# Altium schematic sheet FPGA_IO.SchDoc
size A3
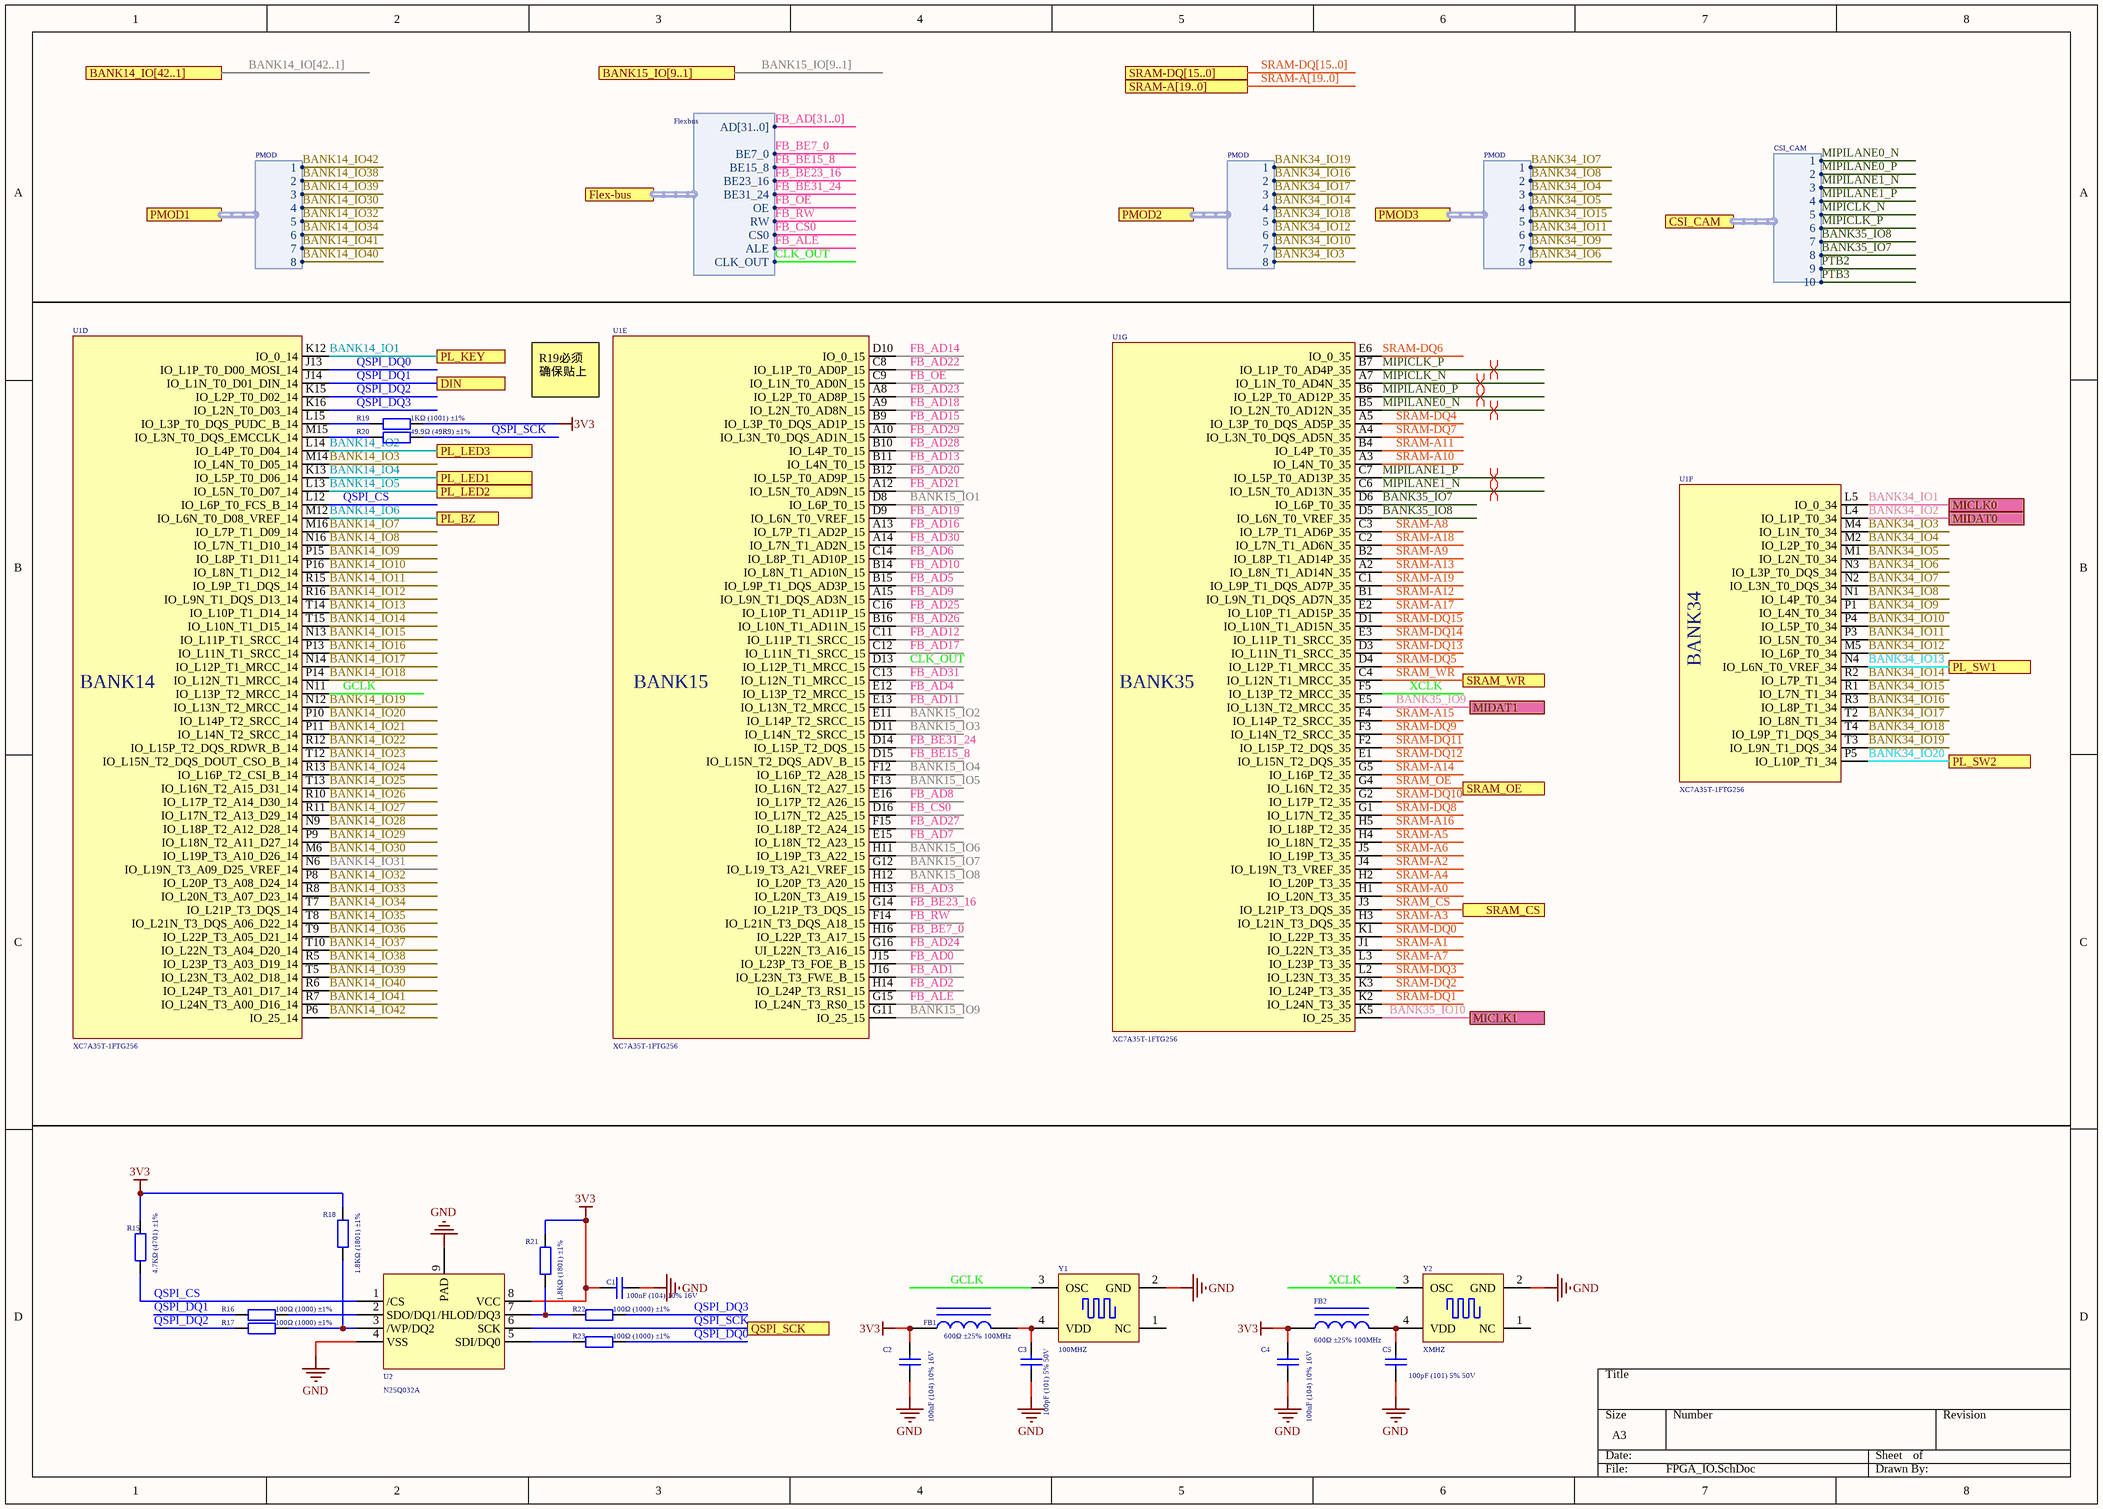
[diagram p0: FPGA_IO.SchDoc]

## Parts
C1  100nF (104) 10% 16V  [0402_C]
C2  100nF (104) 10% 16V  [0402_C]
C3  100pF (101) 5% 50V  [0402_C]
C4  100nF (104) 10% 16V  [0402_C]
C5  100pF (101) 5% 50V  [0402_C]
FB1  600Ω ±25% 100MHz  [0805_L]
FB2  600Ω ±25% 100MHz  [0805_L]
R15  4.7KΩ (4701) ±1%  [0402_R]
R16  100Ω (1000) ±1%  [0402_R]
R17  100Ω (1000) ±1%  [0402_R]
R18  1.8KΩ (1801) ±1%  [0603_R]
R19  1KΩ (1001) ±1%  [0402_R]
R20  49.9Ω (49R9) ±1%  [0402_R]
R21  1.8KΩ (1801) ±1%  [0603_R]
R22  100Ω (1000) ±1%  [0402_R]
R23  100Ω (1000) ±1%  [0402_R]
U1  XC7A35T-1FTG256  [BGA100P9X9-81A]  (parts D,E,F,G of 7)
U2  N25Q032A  [QFN127P500X600X100_HS-9N]
Y1  100MHZ  [XTAL7_3225]
Y2  XMHZ  [XTAL7_3225]

## Ports
BANK14_IO[42..1], BANK15_IO[9..1], CSI_CAM (harness CSI_CAM), DIN, Flex-bus (harness Flexbus), MICLK0, MICLK1, MIDAT0, MIDAT1, PL_BZ, PL_KEY, PL_LED1, PL_LED2, PL_LED3, PL_SW1, PL_SW2, PMOD1 (harness PMOD), PMOD2 (harness PMOD), PMOD3 (harness PMOD), QSPI_SCK, SRAM-A[19..0], SRAM-DQ[15..0], SRAM_CS, SRAM_OE, SRAM_WR

## Harnesses
Flexbus: BE7_0, CS0, BE31_24, CLK_OUT, ALE, BE23_16, RW, BE15_8, OE, AD[31..0]
PMOD: 1, 2, 3, 4, 5, 6, 7, 8
CSI_CAM: 1, 2, 3, 4, 5, 6, 7, 8, 9, 10

## Nets
3V3: C1.1 C2.2 C4.2 FB1.1 FB2.1 R15.2 R18.2 R19.2 R21.2 U2.8(VCC)
GND: C1.2 C2.1 C3.1 C4.1 C5.1 U2.4(VSS) U2.9(PAD) Y1.2(GND) Y2.2(GND)
BANK14_IO1: U1.K12(IO_0_14) ; port PL_KEY
BANK14_IO2: U1.L14(IO_L4P_T0_D04_14) ; port PL_LED3
BANK14_IO3: U1.M14(IO_L4N_T0_D05_14)
BANK14_IO4: U1.K13(IO_L5P_T0_D06_14) ; port PL_LED1
BANK14_IO5: U1.L13(IO_L5N_T0_D07_14) ; port PL_LED2
BANK14_IO6: U1.M12(IO_L6N_T0_D08_VREF_14) ; port PL_BZ
BANK14_IO7: U1.M16(IO_L7P_T1_D09_14)
BANK14_IO8: U1.N16(IO_L7N_T1_D10_14)
BANK14_IO9: U1.P15(IO_L8P_T1_D11_14)
BANK14_IO10: U1.P16(IO_L8N_T1_D12_14)
BANK14_IO11: U1.R15(IO_L9P_T1_DQS_14)
BANK14_IO12: U1.R16(IO_L9N_T1_DQS_D13_14)
BANK14_IO13: U1.T14(IO_L10P_T1_D14_14)
BANK14_IO14: U1.T15(IO_L10N_T1_D15_14)
BANK14_IO15: U1.N13(IO_L11P_T1_SRCC_14)
BANK14_IO16: U1.P13(IO_L11N_T1_SRCC_14)
BANK14_IO17: U1.N14(IO_L12P_T1_MRCC_14)
BANK14_IO18: U1.P14(IO_L12N_T1_MRCC_14)
BANK14_IO19: U1.N12(IO_L13N_T2_MRCC_14)
BANK14_IO20: U1.P10(IO_L14P_T2_SRCC_14)
BANK14_IO21: U1.P11(IO_L14N_T2_SRCC_14)
BANK14_IO22: U1.R12(IO_L15P_T2_DQS_RDWR_B_14)
BANK14_IO23: U1.T12(IO_L15N_T2_DQS_DOUT_CSO_B_14)
BANK14_IO24: U1.R13(IO_L16P_T2_CSI_B_14)
BANK14_IO25: U1.T13(IO_L16N_T2_A15_D31_14)
BANK14_IO26: U1.R10(IO_L17P_T2_A14_D30_14)
BANK14_IO27: U1.R11(IO_L17N_T2_A13_D29_14)
BANK14_IO28: U1.N9(IO_L18P_T2_A12_D28_14)
BANK14_IO29: U1.P9(IO_L18N_T2_A11_D27_14)
BANK14_IO30: U1.M6(IO_L19P_T3_A10_D26_14) ; port PMOD1.4
BANK14_IO31: U1.N6(IO_L19N_T3_A09_D25_VREF_14)
BANK14_IO32: U1.P8(IO_L20P_T3_A08_D24_14) ; port PMOD1.5
BANK14_IO33: U1.R8(IO_L20N_T3_A07_D23_14)
BANK14_IO34: U1.T7(IO_L21P_T3_DQS_14) ; port PMOD1.6
BANK14_IO35: U1.T8(IO_L21N_T3_DQS_A06_D22_14)
BANK14_IO36: U1.T9(IO_L22P_T3_A05_D21_14)
BANK14_IO37: U1.T10(IO_L22N_T3_A04_D20_14)
BANK14_IO38: U1.R5(IO_L23P_T3_A03_D19_14) ; port PMOD1.2
BANK14_IO39: U1.T5(IO_L23N_T3_A02_D18_14) ; port PMOD1.3
BANK14_IO40: U1.R6(IO_L24P_T3_A01_D17_14) ; port PMOD1.8
BANK14_IO41: U1.R7(IO_L24N_T3_A00_D16_14) ; port PMOD1.7
BANK14_IO42: U1.P6(IO_25_14) ; port PMOD1.1
BANK15_IO1: U1.D8(IO_L6P_T0_15)
BANK15_IO2: U1.E11(IO_L14P_T2_SRCC_15)
BANK15_IO3: U1.D11(IO_L14N_T2_SRCC_15)
BANK15_IO4: U1.F12(IO_L16P_T2_A28_15)
BANK15_IO5: U1.F13(IO_L16N_T2_A27_15)
BANK15_IO6: U1.H11(IO_L19P_T3_A22_15)
BANK15_IO7: U1.G12(IO_L19_T3_A21_VREF_15)
BANK15_IO8: U1.H12(IO_L20P_T3_A20_15)
BANK15_IO9: U1.G11(IO_25_15)
BANK34_IO1: U1.L5(IO_0_34) ; port MICLK0
BANK34_IO2: U1.L4(IO_L1P_T0_34) ; port MIDAT0
BANK34_IO3: U1.M4(IO_L1N_T0_34) ; port PMOD2.8
BANK34_IO4: U1.M2(IO_L2P_T0_34) ; port PMOD3.3
BANK34_IO5: U1.M1(IO_L2N_T0_34) ; port PMOD3.4
BANK34_IO6: U1.N3(IO_L3P_T0_DQS_34) ; port PMOD3.8
BANK34_IO7: U1.N2(IO_L3N_T0_DQS_34) ; port PMOD3.1
BANK34_IO8: U1.N1(IO_L4P_T0_34) ; port PMOD3.2
BANK34_IO9: U1.P1(IO_L4N_T0_34) ; port PMOD3.7
BANK34_IO10: U1.P4(IO_L5P_T0_34) ; port PMOD2.7
BANK34_IO11: U1.P3(IO_L5N_T0_34) ; port PMOD3.6
BANK34_IO12: U1.M5(IO_L6P_T0_34) ; port PMOD2.6
BANK34_IO13: U1.N4(IO_L6N_T0_VREF_34) ; port PL_SW1
BANK34_IO14: U1.R2(IO_L7P_T1_34) ; port PMOD2.4
BANK34_IO15: U1.R1(IO_L7N_T1_34) ; port PMOD3.5
BANK34_IO16: U1.R3(IO_L8P_T1_34) ; port PMOD2.2
BANK34_IO17: U1.T2(IO_L8N_T1_34) ; port PMOD2.3
BANK34_IO18: U1.T4(IO_L9P_T1_DQS_34) ; port PMOD2.5
BANK34_IO19: U1.T3(IO_L9N_T1_DQS_34) ; port PMOD2.1
BANK34_IO20: U1.P5(IO_L10P_T1_34) ; port PL_SW2
BANK35_IO7: U1.D6(IO_L6P_T0_35) ; port CSI_CAM.8
BANK35_IO8: U1.D5(IO_L6N_T0_VREF_35) ; port CSI_CAM.7
BANK35_IO9: U1.E5(IO_L13N_T2_MRCC_35) ; port MIDAT1
BANK35_IO10: U1.K5(IO_25_35) ; port MICLK1
CLK_OUT: U1.D13(IO_L12P_T1_MRCC_15) ; port Flex-bus.CLK_OUT
FB_AD0: U1.J15(IO_L23P_T3_FOE_B_15)
FB_AD1: U1.J16(IO_L23N_T3_FWE_B_15)
FB_AD2: U1.H14(IO_L24P_T3_RS1_15)
FB_AD3: U1.H13(IO_L20N_T3_A19_15)
FB_AD4: U1.E12(IO_L13P_T2_MRCC_15)
FB_AD5: U1.B15(IO_L9P_T1_DQS_AD3P_15)
FB_AD6: U1.C14(IO_L8P_T1_AD10P_15)
FB_AD7: U1.E15(IO_L18N_T2_A23_15)
FB_AD8: U1.E16(IO_L17P_T2_A26_15)
FB_AD9: U1.A15(IO_L9N_T1_DQS_AD3N_15)
FB_AD10: U1.B14(IO_L8N_T1_AD10N_15)
FB_AD11: U1.E13(IO_L13N_T2_MRCC_15)
FB_AD12: U1.C11(IO_L11P_T1_SRCC_15)
FB_AD13: U1.B11(IO_L4N_T0_15)
FB_AD14: U1.D10(IO_0_15)
FB_AD15: U1.B9(IO_L3P_T0_DQS_AD1P_15)
FB_AD16: U1.A13(IO_L7P_T1_AD2P_15)
FB_AD17: U1.C12(IO_L11N_T1_SRCC_15)
FB_AD18: U1.A9(IO_L2N_T0_AD8N_15)
FB_AD19: U1.D9(IO_L6N_T0_VREF_15)
FB_AD20: U1.B12(IO_L5P_T0_AD9P_15)
FB_AD21: U1.A12(IO_L5N_T0_AD9N_15)
FB_AD22: U1.C8(IO_L1P_T0_AD0P_15)
FB_AD23: U1.A8(IO_L2P_T0_AD8P_15)
FB_AD24: U1.G16(UI_L22N_T3_A16_15)
FB_AD25: U1.C16(IO_L10P_T1_AD11P_15)
FB_AD26: U1.B16(IO_L10N_T1_AD11N_15)
FB_AD27: U1.F15(IO_L18P_T2_A24_15)
FB_AD28: U1.B10(IO_L4P_T0_15)
FB_AD29: U1.A10(IO_L3N_T0_DQS_AD1N_15)
FB_AD30: U1.A14(IO_L7N_T1_AD2N_15)
FB_AD31: U1.C13(IO_L12N_T1_MRCC_15)
FB_ALE: U1.G15(IO_L24N_T3_RS0_15) ; port Flex-bus.ALE
FB_BE7_0: U1.H16(IO_L22P_T3_A17_15) ; port Flex-bus.BE7_0
FB_BE15_8: U1.D15(IO_L15N_T2_DQS_ADV_B_15) ; port Flex-bus.BE15_8
FB_BE23_16: U1.G14(IO_L21P_T3_DQS_15) ; port Flex-bus.BE23_16
FB_BE31_24: U1.D14(IO_L15P_T2_DQS_15) ; port Flex-bus.BE31_24
FB_CS0: U1.D16(IO_L17N_T2_A25_15) ; port Flex-bus.CS0
FB_OE: U1.C9(IO_L1N_T0_AD0N_15) ; port Flex-bus.OE
FB_RW: U1.F14(IO_L21N_T3_DQS_A18_15) ; port Flex-bus.RW
GCLK: U1.N11(IO_L13P_T2_MRCC_14) Y1.3(OSC)
MIPICLK_N: U1.A7(IO_L1N_T0_AD4N_35) ; port CSI_CAM.5
MIPICLK_P: U1.B7(IO_L1P_T0_AD4P_35) ; port CSI_CAM.6
MIPILANE0_N: U1.B5(IO_L2N_T0_AD12N_35) ; port CSI_CAM.1
MIPILANE0_P: U1.B6(IO_L2P_T0_AD12P_35) ; port CSI_CAM.2
MIPILANE1_N: U1.C6(IO_L5N_T0_AD13N_35) ; port CSI_CAM.3
MIPILANE1_P: U1.C7(IO_L5P_T0_AD13P_35) ; port CSI_CAM.4
PTB2: port CSI_CAM.9
PTB3: port CSI_CAM.10
QSPI_CS: R15.1 U1.L12(IO_L6P_T0_FCS_B_14) U2.1(/CS)
QSPI_DQ0: R23.2 U1.J13(IO_L1P_T0_D00_MOSI_14)
QSPI_DQ1: R16.1 U1.J14(IO_L1N_T0_D01_DIN_14) ; port DIN
QSPI_DQ2: R17.1 U1.K15(IO_L2P_T0_D02_14)
QSPI_DQ3: R22.2 U1.K16(IO_L2N_T0_D03_14)
QSPI_SCK: R20.2 U2.6(SCK) ; port QSPI_SCK
SRAM-A0: U1.H1(IO_L20N_T3_35)
SRAM-A1: U1.J1(IO_L22N_T3_35)
SRAM-A2: U1.J4(IO_L19N_T3_VREF_35)
SRAM-A3: U1.H3(IO_L21N_T3_DQS_35)
SRAM-A4: U1.H2(IO_L20P_T3_35)
SRAM-A5: U1.H4(IO_L18N_T2_35)
SRAM-A6: U1.J5(IO_L19P_T3_35)
SRAM-A7: U1.L3(IO_L23P_T3_35)
SRAM-A8: U1.C3(IO_L7P_T1_AD6P_35)
SRAM-A9: U1.B2(IO_L8P_T1_AD14P_35)
SRAM-A10: U1.A3(IO_L4N_T0_35)
SRAM-A11: U1.B4(IO_L4P_T0_35)
SRAM-A12: U1.B1(IO_L9N_T1_DQS_AD7N_35)
SRAM-A13: U1.A2(IO_L8N_T1_AD14N_35)
SRAM-A14: U1.G5(IO_L16P_T2_35)
SRAM-A15: U1.F4(IO_L14P_T2_SRCC_35)
SRAM-A16: U1.H5(IO_L18P_T2_35)
SRAM-A17: U1.E2(IO_L10P_T1_AD15P_35)
SRAM-A18: U1.C2(IO_L7N_T1_AD6N_35)
SRAM-A19: U1.C1(IO_L9P_T1_DQS_AD7P_35)
SRAM-DQ0: U1.K1(IO_L22P_T3_35)
SRAM-DQ1: U1.K2(IO_L24N_T3_35)
SRAM-DQ2: U1.K3(IO_L24P_T3_35)
SRAM-DQ3: U1.L2(IO_L23N_T3_35)
SRAM-DQ4: U1.A5(IO_L3P_T0_DQS_AD5P_35)
SRAM-DQ5: U1.D4(IO_L12P_T1_MRCC_35)
SRAM-DQ6: U1.E6(IO_0_35)
SRAM-DQ7: U1.A4(IO_L3N_T0_DQS_AD5N_35)
SRAM-DQ8: U1.G1(IO_L17N_T2_35)
SRAM-DQ9: U1.F3(IO_L14N_T2_SRCC_35)
SRAM-DQ10: U1.G2(IO_L17P_T2_35)
SRAM-DQ11: U1.F2(IO_L15P_T2_DQS_35)
SRAM-DQ12: U1.E1(IO_L15N_T2_DQS_35)
SRAM-DQ13: U1.D3(IO_L11N_T1_SRCC_35)
SRAM-DQ14: U1.E3(IO_L11P_T1_SRCC_35)
SRAM-DQ15: U1.D1(IO_L10N_T1_AD15N_35)
SRAM_CS: U1.J3(IO_L21P_T3_DQS_35) ; port SRAM_CS
SRAM_OE: U1.G4(IO_L16N_T2_35) ; port SRAM_OE
SRAM_WR: U1.C4(IO_L12N_T1_MRCC_35) ; port SRAM_WR
XCLK: U1.F5(IO_L13P_T2_MRCC_35) Y2.3(OSC)
NetC3_2: C3.2 FB1.2 Y1.4(VDD)
NetC5_2: C5.2 FB2.2 Y2.4(VDD)
NetR16_2: R16.2 U2.2(SDO/DQ1)
NetR17_2: R17.2 R18.1 U2.3(/WP/DQ2)
NetR19_1: R19.1 U1.L15(IO_L3P_T0_DQS_PUDC_B_14)
NetR20_1: R20.1 U1.M15(IO_L3N_T0_DQS_EMCCLK_14)
NetR21_1: R21.1 R22.1 U2.7(/HLOD/DQ3)
NetR23_1: R23.1 U2.5(SDI/DQ0)

Not connected (* = marked no-connect by the designer): Y1 1(NC); Y2 1(NC)

## Buses and harness runs
bus BANK14_IO[42..1] = port BANK14_IO[42..1]
bus BANK15_IO[9..1] = port BANK15_IO[9..1]
bus FB_AD[31..0]
bus SRAM-A[19..0] = port SRAM-A[19..0]
bus SRAM-DQ[15..0] = port SRAM-DQ[15..0]

## Layout directives
differential pair: MIPICLK_N, MIPICLK_P, MIPILANE0_N, MIPILANE0_P, MIPILANE1_N, MIPILANE1_P

## Notes on the sheet
- R19必须确保贴上
- (in symbol XC7A35T-1FTG256, part D) BANK14
- (in symbol XC7A35T-1FTG256, part E) BANK15
- (in symbol XC7A35T-1FTG256, part F) BANK34
- (in symbol XC7A35T-1FTG256, part G) BANK35

## Library data of the parts
C1 C2 C4 = 0402 100nF (104) 10% 16V: 贴片电容; ComponentLink1Description: 供应商链接; ComponentLink1URL: http://www.szlcsc.com/product/details_1877.html; Package: 0402; Supplier: LC; SuppliersPartNumber: C1525
C3 C5 = 0402 100pF (101) 5% 50V: 贴片电容; ComponentLink1Description: 供应商链接; ComponentLink1URL: http://www.szlcsc.com/product/details_1898.html; Package: 0402; Supplier: LC; SuppliersPartNumber: C1546
FB1 FB2 = 0805 600Ω 25% 100MHz: 贴片磁珠; ComponentLink1Description: 供应商链接; ComponentLink1URL: http://www.szlcsc.com/product/details_1369.html; Package: 0805; Supplier: LC; SuppliersPartNumber: C1017
R15 = 0402 4.7KΩ (4701) 1%: 贴片电阻; ComponentLink1Description: 供应商链接; ComponentLink1URL: http://www.szlcsc.com/product/details_26643.html; Package: 0402; Supplier: LC; SuppliersPartNumber: C25900
R16 R17 R22 R23 = 0402 100Ω (1000) 1%: 贴片电阻; ComponentLink1Description: 供应商链接; ComponentLink1URL: http://www.szlcsc.com/product/details_25819.html; Package: 0402; Supplier: LC; SuppliersPartNumber: C25076
R18 R21 = 0603 1.8KΩ (1801) 1%: 贴片电阻; ComponentLink1Description: 供应商链接; ComponentLink1URL: http://www.szlcsc.com/product/details_4584.html; Package: 0603; Supplier: LC; SuppliersPartNumber: C4177
R19 = 0402 1KΩ (1001) 1%: 贴片电阻; ComponentLink1Description: 供应商链接; ComponentLink1URL: http://www.szlcsc.com/product/details_12256.html; Package: 0402; Supplier: LC; SuppliersPartNumber: C11702
R20 = 0402 49.9Ω (49R9) 1%: 贴片电阻; ComponentLink1Description: 供应商链接; ComponentLink1URL: http://www.szlcsc.com/product/details_25863.html; Package: 0402; Supplier: LC; SuppliersPartNumber: C25120
Y1 Y2 = XTAL1